# EAGLE schematic dendHub (EAGLE 9.6.2)

## Sheet 1 of 4
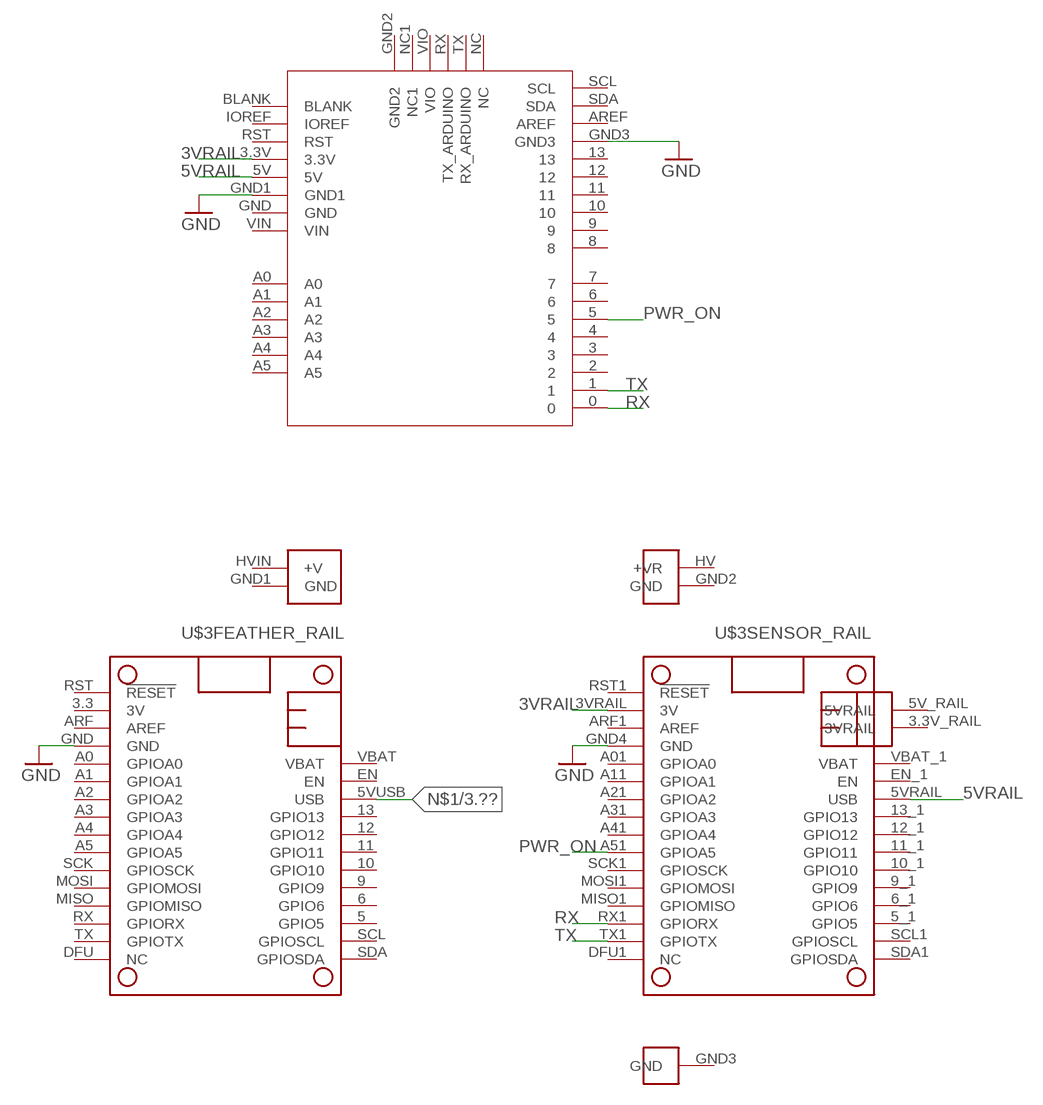
[diagram p0: schematic, sheet 1]

### Parts
U$1  LTE_BOARD  [LTE_BOARD_FOOTPRINT]
U$3  HYPNOS_V3  [HYPNOS_V3]

### Nets
3VRAIL: U$1.3.3V U$3.3VRAIL(SENSOR_RAIL:3V)
5VRAIL: U$1.5V U$3.5VRAIL(SENSOR_RAIL:USB)
GND: U$1.GND1 U$1.GND3 U$3.GND4(SENSOR_RAIL:GND) U$3.GND(FEATHER_RAIL:GND) ; also sheet 2,3
N$1: U$3.5VUSB(FEATHER_RAIL:USB) ; also sheet 3
PWR_ON: U$1.5 U$3.A51(SENSOR_RAIL:GPIOA5)
RX: U$1.0 U$3.RX1(SENSOR_RAIL:GPIORX)
TX: U$1.1 U$3.TX1(SENSOR_RAIL:GPIOTX)
Unconnected: U$1.2 U$1.3 U$1.4 U$1.6 U$1.7 U$1.8 U$1.9 U$1.10 U$1.11 U$1.12 U$1.13 U$1.A0 U$1.A1 U$1.A2 U$1.A3 U$1.A4 U$1.A5 U$1.AREF U$1.BLANK U$1.GND U$1.GND2 U$1.IOREF U$1.NC U$1.NC1 U$1.RST U$1.RX(TX_ARDUINO) U$1.SCL U$1.SDA U$1.TX(RX_ARDUINO) U$1.VIN U$1.VIO U$3.3.3(FEATHER_RAIL:3V) U$3.3.3V_RAIL(3VRAIL) U$3.5(FEATHER_RAIL:GPIO5) U$3.5_1(SENSOR_RAIL:GPIO5) U$3.5V_RAIL(5VRAIL) U$3.6(FEATHER_RAIL:GPIO6) U$3.6_1(SENSOR_RAIL:GPIO6) U$3.9(FEATHER_RAIL:GPIO9) U$3.9_1(SENSOR_RAIL:GPIO9) U$3.10(FEATHER_RAIL:GPIO10) U$3.10_1(SENSOR_RAIL:GPIO10) U$3.11(FEATHER_RAIL:GPIO11) U$3.11_1(SENSOR_RAIL:GPIO11) U$3.12(FEATHER_RAIL:GPIO12) U$3.12_1(SENSOR_RAIL:GPIO12) U$3.13(FEATHER_RAIL:GPIO13) U$3.13_1(SENSOR_RAIL:GPIO13) U$3.A0(FEATHER_RAIL:GPIOA0) U$3.A1(FEATHER_RAIL:GPIOA1) U$3.A01(SENSOR_RAIL:GPIOA0) U$3.A2(FEATHER_RAIL:GPIOA2) U$3.A3(FEATHER_RAIL:GPIOA3) U$3.A4(FEATHER_RAIL:GPIOA4) U$3.A5(FEATHER_RAIL:GPIOA5) U$3.A11(SENSOR_RAIL:GPIOA1) U$3.A21(SENSOR_RAIL:GPIOA2) U$3.A31(SENSOR_RAIL:GPIOA3) U$3.A41(SENSOR_RAIL:GPIOA4) U$3.ARF1(SENSOR_RAIL:AREF) U$3.ARF(FEATHER_RAIL:AREF) U$3.DFU1(SENSOR_RAIL:NC) U$3.DFU(FEATHER_RAIL:NC) U$3.EN(FEATHER_RAIL:EN) U$3.EN_1(SENSOR_RAIL:EN) U$3.GND1(GND) U$3.GND2(GND) U$3.GND3(GND) U$3.HV(+VR) U$3.HVIN(+V) U$3.MISO1(SENSOR_RAIL:GPIOMISO) U$3.MISO(FEATHER_RAIL:GPIOMISO) U$3.MOSI1(SENSOR_RAIL:GPIOMOSI) U$3.MOSI(FEATHER_RAIL:GPIOMOSI) U$3.RST1(SENSOR_RAIL:!RESET) U$3.RST(FEATHER_RAIL:!RESET) U$3.RX(FEATHER_RAIL:GPIORX) U$3.SCK1(SENSOR_RAIL:GPIOSCK) U$3.SCK(FEATHER_RAIL:GPIOSCK) U$3.SCL1(SENSOR_RAIL:GPIOSCL) U$3.SCL(FEATHER_RAIL:GPIOSCL) U$3.SDA1(SENSOR_RAIL:GPIOSDA) U$3.SDA(FEATHER_RAIL:GPIOSDA) U$3.TX(FEATHER_RAIL:GPIOTX) U$3.VBAT(FEATHER_RAIL:VBAT) U$3.VBAT_1(SENSOR_RAIL:VBAT)

## Sheet 2 of 4
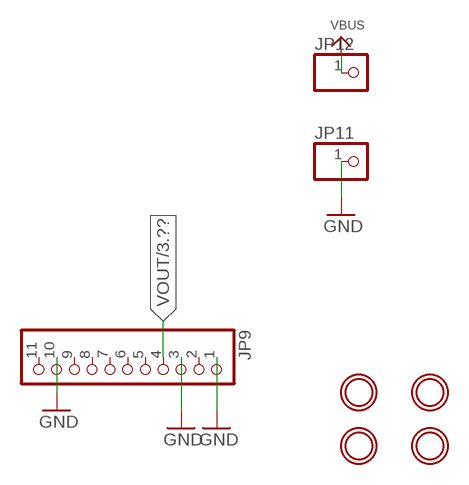
[diagram p1: schematic, sheet 2]

### Parts
JP9  HEADER-1X1176MIL  [1X11_ROUND_76]
JP11  HEADER-1X1  [1X01_OVAL]
JP12  HEADER-1X1  [1X01_OVAL]
U$45  MOUNTINGHOLE2.5  [MOUNTINGHOLE_2.5_PLATED]
U$46  MOUNTINGHOLE2.5  [MOUNTINGHOLE_2.5_PLATED]
U$47  MOUNTINGHOLE2.5  [MOUNTINGHOLE_2.5_PLATED]
U$48  MOUNTINGHOLE2.5  [MOUNTINGHOLE_2.5_PLATED]

### Nets
GND: JP9.1 JP9.3 JP9.10 JP11.1 ; also sheet 1,3
VBUS: JP12.1
VOUT: JP9.4 ; also sheet 3
Unconnected: JP9.2 JP9.5 JP9.6 JP9.7 JP9.8 JP9.9 JP9.11

## Sheet 3 of 4
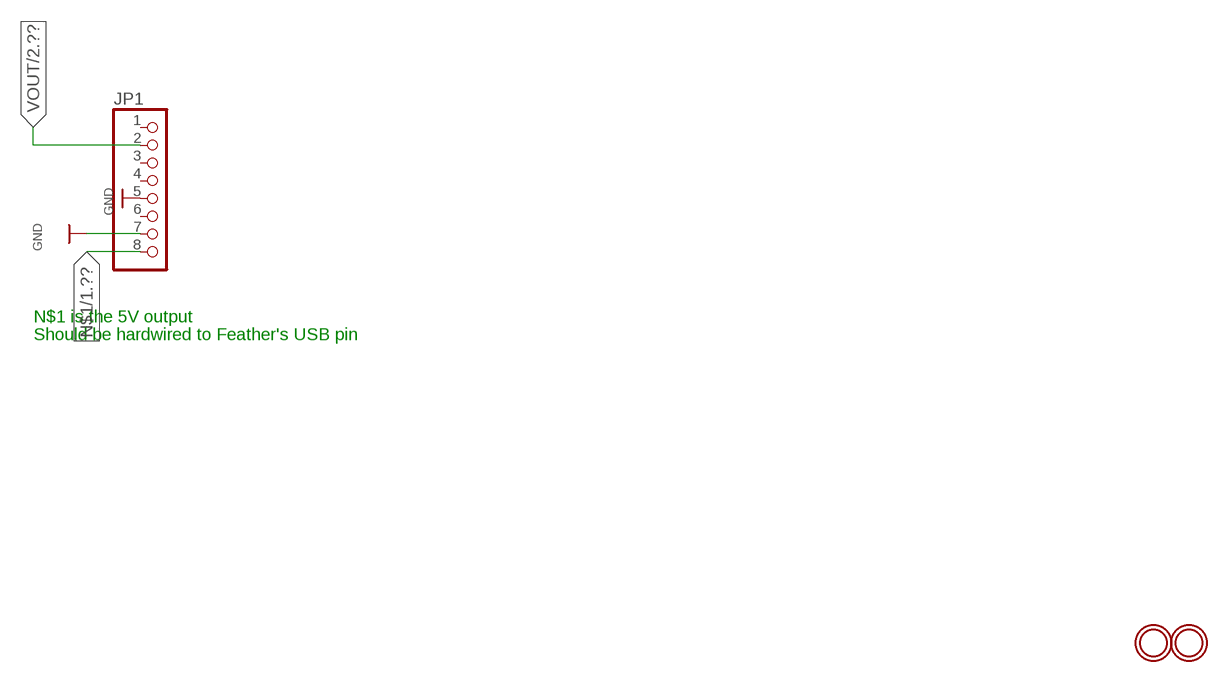
[diagram p2: schematic, sheet 3]

### Parts
JP1  HEADER-1X8ROUND  [1X08_ROUND]
U$56  MOUNTINGHOLE2.5  [MOUNTINGHOLE_2.5_PLATED]
U$57  MOUNTINGHOLE2.5  [MOUNTINGHOLE_2.5_PLATED]

### Nets
GND: JP1.5 JP1.7 ; also sheet 1,2
N$1: JP1.8 ; also sheet 1
VOUT: JP1.2 ; also sheet 2
Unconnected: JP1.1 JP1.3 JP1.4 JP1.6

### Notes on the sheet
- N$1 is the 5V output
- Should be hardwired to Feather's USB pin

## Sheet 4 of 4

## Library data of the parts
JP1 = microbuilder:HEADER-1X8: PIN HEADER
JP9 = microbuilder:HEADER-1X11
JP11 JP12 = microbuilder:HEADER-1X1: PIN HEADER
U$1 = LTE_BOARD:LTE_BOARD: LTE_BOARD
U$3 = HYPNOS_V3:HYPNOS_V3
U$45-U$48 U$56 U$57 = microbuilder:MOUNTINGHOLE: Mounting Hole For #2 screws (0.086"/2.18mm width, 0.094"/2.4mm hole) use 2.5mm; BOM: EXCLUDE

## Net classes
1 USB_Data: width 0.152 mm, drill 0.305 mm, clearance 0.152 mm
2 HIGHVOLTAGE: clearance 0.3 mm